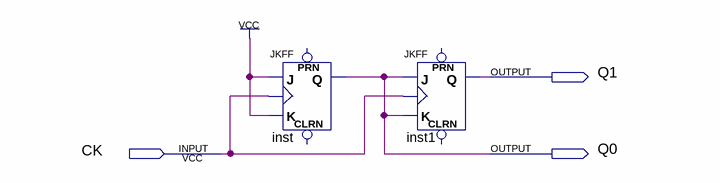
[diagram p0: schematic sheet]
// Quartus schematic 4_MOD_S_U.bdf as structural Verilog: 2 symbols, 3 pins
module \4_MOD_S_U  (
  input  CK,
  output Q1,
  output Q0
);

  JKFF inst (.K(1'b1), .J(1'b1), .CLK(CK), .Q(Q0));  // open: PRN, CLRN
  JKFF inst1 (.K(Q0), .J(Q0), .CLK(CK), .Q(Q1));  // open: PRN, CLRN
endmodule
